# Altium schematic sheet RS485_232_CAN.SchDoc
size A3; Author: HamidFijani; DrawnBy: HamidFijani; SheetNumber: 10; SheetTotal: 13
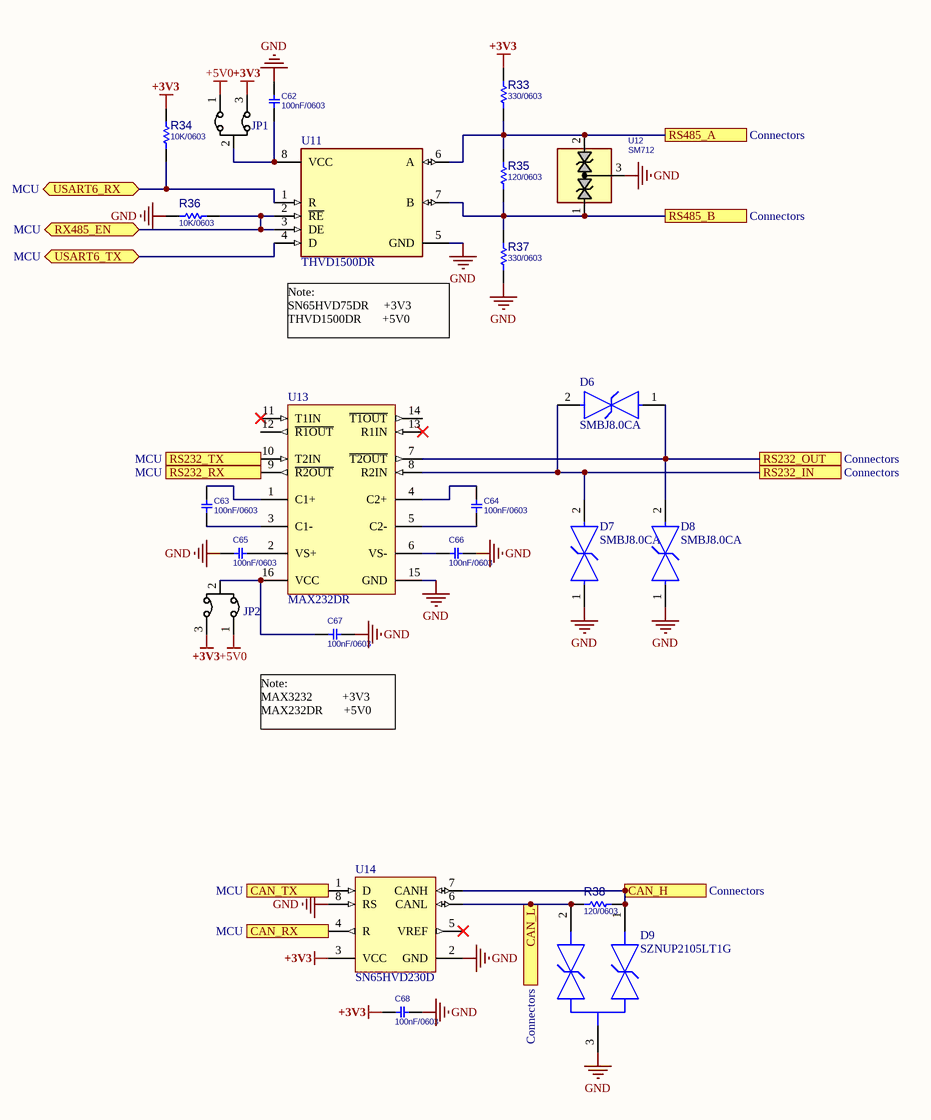
[diagram p0: RS485_232_CAN.SchDoc]

## Parts
?  (no value)  (graphical)
C62  100nF/0603  [C0603]
C63  100nF/0603  [C0603]
C64  100nF/0603  [C0603]
C65  100nF/0603  [C0603]
C66  100nF/0603  [C0603]
C67  100nF/0603  [C0603]
C68  100nF/0603  [C0603]
D6  SMBJ8.0CA  [FP-DO-214AA-CA-MFG]
D7  SMBJ8.0CA  [FP-DO-214AA-CA-MFG]
D8  SMBJ8.0CA  [FP-DO-214AA-CA-MFG]
D9  SZNUP2105LT1G  [FP-318-08-MFG]
JP1  JMPHDR3PIN  [JP_3_40X90]  (value not drawn)  (no BOM)
JP2  JMPHDR3PIN  [JP_3_40X90]  (value not drawn)  (no BOM)
R33  330/0603  [R0603]
R34  10K/0603  [R0603]
R35  120/0603  [R0603]
R36  10K/0603  [R0603]
R37  330/0603  [R0603]
R38  120/0603  [R0603]
U11  THVD1500DR  [FP-D0008A-MFG]
U12  SM712  [SOT23_3]
U13  MAX232DR  [D0016A_N]
U14  SN65HVD230D  [D0008A_M]

## Ports
CAN_H (see Connectors), CAN_L (see Connectors), CAN_RX (see MCU), CAN_TX (see MCU), RS232_IN (see Connectors), RS232_OUT (see Connectors), RS232_RX (see MCU), RS232_TX (see MCU), RS485_A (see Connectors), RS485_B (see Connectors), RX485_EN (bidir, see MCU), USART6_RX (bidir, see MCU), USART6_TX (bidir, see MCU)

## Nets
+3V3: C68.1 JP1.3 JP2.3 R33.1 R34.1 U14.3(VCC)
+5V0: JP1.1 JP2.1
GND: C62.2 C65.2 C66.1 C67.2 C68.2 D7.1 D8.1 D9.3 R36.1 R37.2 U11.5(GND) U12.3(NC) U13.15(GND) U14.2(GND) U14.8(RS)
CAN_H: D9.1 R38.2 U14.7(CANH) ; port CAN_H
CAN_L: D9.2 R38.1 U14.6(CANL) ; port CAN_L
CAN_RX: U14.4(R) ; port CAN_RX
CAN_TX: U14.1(D) ; port CAN_TX
RS232_IN: D6.2 D7.2 U13.8(R2IN) ; port RS232_IN
RS232_OUT: D6.1 D8.2 U13.7(~{T2OUT}) ; port RS232_OUT
RS232_RX: U13.9(~{R2OUT}) ; port RS232_RX
RS232_TX: U13.10(T2IN) ; port RS232_TX
RS485_A: R33.2 R35.1 U11.6(A) U12.2(GND) ; port RS485_A
RS485_B: R35.2 R37.1 U11.7(B) U12.1(NC) ; port RS485_B
RX485_EN: R36.2 U11.2(~{RE}) U11.3(DE) ; port RX485_EN
USART6_RX: R34.2 U11.1(R) ; port USART6_RX
USART6_TX: U11.4(D) ; port USART6_TX
NetC62_1: C62.1 JP1.2 U11.8(VCC)
NetC63_1: C63.1 U13.3(C1-)
NetC63_2: C63.2 U13.1(C1+)
NetC64_1: C64.1 U13.5(C2-)
NetC64_2: C64.2 U13.4(C2+)
NetC65_1: C65.1 U13.2(VS+)
NetC66_2: C66.2 U13.6(VS-)
NetC67_1: C67.1 JP2.2 U13.16(VCC)

Not connected (* = marked no-connect by the designer): U13 11(T1IN)* 12(~{R1OUT}) 13(R1IN)* 14(~{T1OUT}); U14 5(VREF)*

## Notes on the sheet
- Note:
  SN65HVD75DR     +3V3
  THVD1500DR       +5V0
- Note:
  MAX3232          +3V3
  MAX232DR       +5V0
- Title:
- Page Contents:
- Variant:
- Checked by
- Size:
- Date:
- DWG NO
- Sheet
- of
- Revision:

## Library data of the parts
? = SDTitleBlock
C62-C68 = CAP_SMD_MLCC_0402: CAP, MLCC, -F, -V, MATERIAL, -%, 0201; PARAM: -, -%; MANF_P#: MANF_PART#; PRICE: 100= 1$; MANF: -; PARAM2: -V; ASSEMBLY: ASSEMBLY; VALUE: 100nF/0603
D6-D8 = CMP-06396-000048-1: TVS DIODE 90VWM 146VC SMBJ
D9 = CMP-1063-00167-2: TVS DIODE 24V 44V SOT23-3; Manufacturer: ON Semiconductor; Capacitance: 30pF; Max Junction Temp: +150°C; Breakdown Voltage: 26.2V; Number Of Channels: 2; Automotive Grade: Grade 0; Standoff Height: 0.01mm; Peak Pulse Current: 8A; Value: 30pF; Direction: Bidirectional; Peak Pulse Power: 350W; Octopart: https://octopart.com/sznup2105lt1g-on+semiconductor-22134626; Reverse Standoff Voltage: 24V; Digikey Description: TVS DIODE 24V 44V SOT23-3; RoHS: TRUE; Manufacturer Part Number: SZNUP2105LT1G; Height: 1.11mm; Automotive: Yes; ComponentLink2URL: https://www.onsemi.com/pub/Collateral/NUP2105L-D.PDF; Device Class L3: unset; Package: 318-08; Lead Free: Yes; Device Class L2: TVS Diodes; Footprint Url: https://www.onsemi.com/pub/Collateral/318-08.PDF; Temperature Range Low: -55°C; Device Class L1: Circuit Protection; Temperature: -55°C to +150°C; Temperature Range High: +150°C; Category: Diode; Clamping Voltage: 44V; ComponentLink2Description: Datasheet
JP1 JP2 = JUMPER_SOLDER_3P: JUMPER, HEADER 3PIN; MANF: MANF; MANF_P#: MANF_P#; VALUE: JMPHDR3PIN
R33-R38 = RES_SMD_0603: RESISTOR, SMD; PARAM: -W; DESC: DESCRIPTION; DIST#: MOUSER; PARAM2: 1%; MANF_P#: -; MANF: -; ASSEMBLY: ASSEMBLY; PRICE: 100= 0.5$
  R33 R37: VALUE: 330/0603
  R34 R36: VALUE: 10K/0603
  R35 R38: VALUE: 120/0603
U11 = CMP-0694-00003-3: IC TRANSCEIVER HALF 1/1 8SOIC; Max Supply Voltage: 3.6V; Number of Receivers: 1; Data Rate: 20Mbps; Operating Supply Voltage: 3.3V; Simplex/Duplex: Half Duplex; Receiver Hysteresis: 80mV; Interface: RS-422; Supply Current: 950uA; Min Supply Voltage: 3V; Lead Free: Lead Free; Max Operating Temperature: 125°C; Min Operating Temperature: -40°C; Packaging: Tape and Reel; REACH SVHC: No SVHC; Number of Transmitters: 1; Logic Function: Transceiver; Radiation Hardening: No; RoHS Compliant: Yes; Number of Drivers: 1; Contact Plating: Gold; Series: -; Number of Transceivers: 1; Case/Package: D; Package Quantity: 2500; Number of Pins: 8; Nominal Supply Current: 950uA
U12 = TVS_X2_CDSOT23-SM712: TVS, ESD PROTECT, 2CH, 400W/17A PP, 7.5VBR, ±8KV ESDmin; MANF: Bourns; PARAM: 400W/17A peak-pulse; MANF_P#: SM712; PARAM2: 7.5VBR, ±8KV ESD min; PRICE: 1.6$; VALUE: SM712
U13 = CMP-0299-00150-2: Dual EIA-232 Driver / Receiver, 0 to 70 degC, 16-Pin SOIC (D), Green (RoHS & no Sb/Br); Single Supply: TRUE; Supply Voltage(s)(V): 5; SubFamily: RS-232; Drivers Per Package: 2; ICC(Max)(mA): 10; ESD HBM(kV): +/-2; ComponentLink1Description: Manufacturer URL; ComponentLink2Description: Datasheet; RS-232: TRUE; ComponentLink3URL: http://www.ti.com/litv/pdf/mpds178g; DatasheetVersion: SLLS047L; ComponentLink1URL: www.ti.com; PackageDescription: 16-Pin Plastic Small Outline Integrated Circuit, 9.9 x 3.9 mm, Pitch 1.27 mm Pitch; PackageVersion: revM, Jun-2011; ComponentLink2URL: http://www.ti.com/general/docs/lit/getliterature.tsp?genericPartNumber=MAX232&fileType=pdf; ComponentLink3Description: Package Specification; PackageReference: D0016A; Receivers Per Package: 2
U14 = CMP-0315-00046-3: CAN Bus Transceiver, 3.3 V, -40 to 85 degC, 8-Pin SOIC (D), Green (RoHS & no Sb/Br), Tube; Supply Voltage Min: 3 V; Supply Voltage Max: 3.6 V; PartNumber: SN65HVD230D; ComponentLink2URL: http://www.ti.com/general/docs/lit/getliterature.tsp?genericGeneric Part Number=SN65HVD230&fileType=pdf; DatasheetVersion: SLOS346N; Generic Part Number: SN65HVD230; Packing: Tube; Temperature Min: -40 degC; Temperature Max: 85 degC; ComponentLink1Description: Manufacturer URL; Mounting Technology: Surface Mount; RoHS: TRUE; ComponentLink1URL: http://www.ti.com/; ComponentLink2Description: Datasheet; PackageDescription: 8-Pin Plastic Small Outline, Body 4.9 x 3.9 mm, Pitch 1.27 mm